# Altium schematic sheet Sensors_Schematic.SchDoc
size A; SheetNumber: 3; SheetTotal: 3
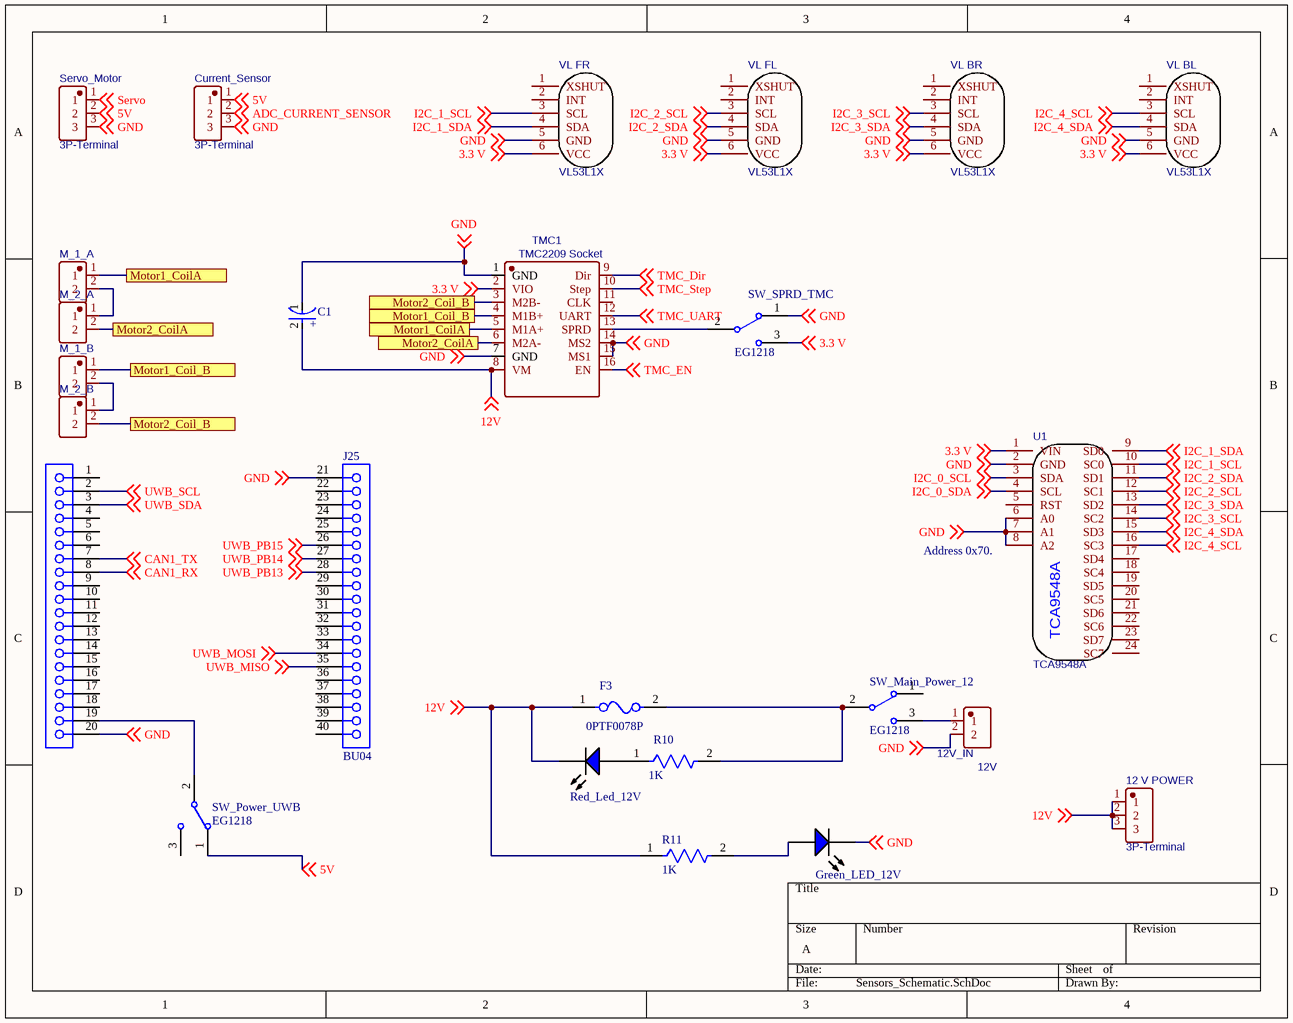
[diagram p0: Sensors_Schematic.SchDoc]

## Parts
12_V_POWER  3P-Terminal  [CONN-TH_3P-P5.00_KF126-5.0-3P]
12V  12V_IN  [CONN-TH_P5.00_KF126-5.0-2P]
C1  EEUFM1E101B  [FP-RAD-TH-D_6_3_0_5-L_11-MFG]  (value not drawn)
Current_Sensor  3P-Terminal  [CONN-TH_3P-P5.00_KF126-5.0-3P]
F3  0PTF0078P  [FP-0PTF0078P-MFG]
Green_LED_12V  WP710A10QBC/D  [KING-WP710A10QBCD_V]  (value not drawn)
J25  BU04  [BU04_KIT_N]
M_1_A  (no value)  [CONN-TH_P5.00_KF126-5.0-2P]
M_1_B  (no value)  [CONN-TH_P5.00_KF126-5.0-2P]
M_2_A  (no value)  [CONN-TH_P5.00_KF126-5.0-2P]
M_2_B  (no value)  [CONN-TH_P5.00_KF126-5.0-2P]
R10  1K  [FP-MFR-12-MFG]
R11  1K  [FP-MFR-12-MFG]
Red_Led_12V  WP710A10QBC/D  [KING-WP710A10QBCD_V]  (value not drawn)
Servo_Motor  3P-Terminal  [CONN-TH_3P-P5.00_KF126-5.0-3P]
SW_Main_Power_12  EG1218  [ESWI-EG1218_V]
SW_Power_UWB  EG1218  [ESWI-EG1218_V]
SW_SPRD_TMC  EG1218  [ESWI-EG1218_V]
TMC1  TMC2209 Socket  [COMM-TH_TMC2209SILENTSTEPSTICK]
U1  TCA9548A  [TCA9548A]
VL_BL  VL53L1X  [VL53L1X_BREAKOUT]
VL_BR  VL53L1X  [VL53L1X_BREAKOUT]
VL_FL  VL53L1X  [VL53L1X_BREAKOUT]
VL_FR  VL53L1X  [VL53L1X_BREAKOUT]

## Ports
Motor1_Coil_B (see Sensors_Schematic[1B]), Motor1_Coil_B (see Sensors_Schematic[2B]), Motor1_CoilA (see Sensors_Schematic[1B]), Motor1_CoilA (see Sensors_Schematic[2B]), Motor2_Coil_B (see Sensors_Schematic[1B]), Motor2_Coil_B (see Sensors_Schematic[2B]), Motor2_CoilA (see Sensors_Schematic[1B]), Motor2_CoilA (see Sensors_Schematic[2B])

## Nets
3.3 V: SW_SPRD_TMC.3 TMC1.2(VIO) U1.1(VIN) VL_BL.6(VCC) VL_BR.6(VCC) VL_FL.6(VCC) VL_FR.6(VCC) ; off-sheet 3.3 V
5V: Current_Sensor.1 Servo_Motor.2 SW_Power_UWB.1 ; off-sheet 5V
12V: 12_V_POWER.1 12_V_POWER.2 12_V_POWER.3 C1.2(A) F3.1 R11.1 Red_Led_12V.2(K) TMC1.8(VM) ; off-sheet 12V
ADC_CURRENT_SENSOR: Current_Sensor.2 ; off-sheet ADC_CURRENT_SENSOR
CAN1_RX: J25.8 ; off-sheet CAN1_RX
CAN1_TX: J25.7 ; off-sheet CAN1_TX
GND: 12V.2 C1.1(C) Current_Sensor.3 Green_LED_12V.2(K) J25.20 J25.21 Servo_Motor.3 SW_SPRD_TMC.1 TMC1.1(GND) TMC1.7(GND) TMC1.14(MS2) TMC1.15(MS1) U1.2(GND) U1.6(A0) U1.7(A1) U1.8(A2) VL_BL.5(GND) VL_BR.5(GND) VL_FL.5(GND) VL_FR.5(GND) ; off-sheet GND
I2C_0_SCL: U1.3(SDA) ; off-sheet I2C_0_SCL
I2C_0_SDA: U1.4(SCL) ; off-sheet I2C_0_SDA
I2C_1_SCL: U1.10(SC0) VL_FR.3(SCL) ; off-sheet I2C_1_SCL
I2C_1_SDA: U1.9(SD0) VL_FR.4(SDA) ; off-sheet I2C_1_SDA
I2C_2_SCL: U1.12(SC1) VL_FL.3(SCL) ; off-sheet I2C_2_SCL
I2C_2_SDA: U1.11(SD1) VL_FL.4(SDA) ; off-sheet I2C_2_SDA
I2C_3_SCL: U1.14(SC2) VL_BR.3(SCL) ; off-sheet I2C_3_SCL
I2C_3_SDA: U1.13(SD2) VL_BR.4(SDA) ; off-sheet I2C_3_SDA
I2C_4_SCL: U1.16(SC3) VL_BL.3(SCL) ; off-sheet I2C_4_SCL
I2C_4_SDA: U1.15(SD3) VL_BL.4(SDA) ; off-sheet I2C_4_SDA
Motor1_Coil_B: M_1_B.1 TMC1.4(M1B+) ; port Motor1_Coil_B
Motor1_CoilA: M_1_A.1 TMC1.5(M1A+) ; port Motor1_CoilA
Motor2_Coil_B: M_2_B.2 TMC1.3(M2B-) ; port Motor2_Coil_B
Motor2_CoilA: M_2_A.2 TMC1.6(M2A-) ; port Motor2_CoilA
Servo: Servo_Motor.1 ; off-sheet Servo
TMC_Dir: TMC1.9(Dir) ; off-sheet TMC_Dir
TMC_EN: TMC1.16(EN) ; off-sheet TMC_EN
TMC_Step: TMC1.10(Step) ; off-sheet TMC_Step
TMC_UART: TMC1.12(UART) ; off-sheet TMC_UART
UWB_MISO: J25.35 ; off-sheet UWB_MISO
UWB_MOSI: J25.34 ; off-sheet UWB_MOSI
UWB_PB13: J25.28 ; off-sheet UWB_PB13
UWB_PB14: J25.27 ; off-sheet UWB_PB14
UWB_PB15: J25.26 ; off-sheet UWB_PB15
UWB_SCL: J25.2 ; off-sheet UWB_SCL
UWB_SDA: J25.3 ; off-sheet UWB_SDA
Net12V_1: 12V.1 SW_Main_Power_12.3
NetF3_2: F3.2 R10.2 SW_Main_Power_12.2(COM)
NetGreen_LED_12V_1: Green_LED_12V.1(A) R11.2
NetJ25_19: J25.19 SW_Power_UWB.2(COM)
NetM_1_A_2: M_1_A.2 M_2_A.1
NetM_1_B_2: M_1_B.2 M_2_B.1
NetR10_1: R10.1 Red_Led_12V.1(A)
NetSW_SPRD_TMC_2: SW_SPRD_TMC.2(COM) TMC1.13(SPRD)

Not connected (* = marked no-connect by the designer): J25 1 4 5 6 9 10 11 12 13 14 15 16 17 18 22 23 24 25 29 30 31 32 33 36 37 38 39 40; SW_Main_Power_12 1; SW_Power_UWB 3; TMC1 11(CLK); U1 5(RST) 17(SD4) 18(SC4) 19(SD5) 20(SC5) 21(SD6) 22(SC6) 23(SD7) 24(SC7); VL_BL 1(XSHUT) 2(INT); VL_BR 1(XSHUT) 2(INT); VL_FL 1(XSHUT) 2(INT); VL_FR 1(XSHUT) 2(INT)

## Notes on the sheet
- (near U1) Address 0x70.
- (in symbol CMP-05427-000856-1) +

## Library data of the parts
12_V_POWER Current_Sensor Servo_Motor = Limit Switch: Manufacturer: Cixi Kefa Elec; Manufacturer Part: KF126-5.0-3P; Contributor: thulasikrishna; Supplier: LCSC; Supplier Part: C474901; JLCPCB Part Class: Extended Part; spicePre: U; spiceSymbolName: KF126-5.0-3P
12V M_1_A M_1_B M_2_A M_2_B = KF126-5.0-2P: Manufacturer: Cixi Kefa Elec; Contributor: LCSC; Supplier: LCSC; Supplier Part: C474900; Manufacturer Part: KF126-5.0-2P; spicePre: P; spiceSymbolName: KF126-5.0-2P
C1 = CMP-05427-000856-1: Aluminum Electrolytic Capacitors (Radial Lead Type) 100uF ±20% 25V; Lead Diameter: 0.5mm; Polarity: Polar; Ripple Current: 455mA; Impedance: 130mR; Life (Hours): 2000Hour; Length: 11mm; Min Operating Temperature: -40°C; Termination: Radial; Diameter: 6mm; Lead Pitch: 5mm; Tolerance: 20%; Capacitance: 100uF; Case/Package: Radial; Voltage Rating (DC): 25V; Height - Seated (Max): 0.5inch; RoHS Compliant: Yes; Series: FM; Package Quantity: 2000; Voltage Rating: 25V; Max Operating Temperature: 105°C; Mount: Through Hole; ESR (Equivalent Series Resistance): 130mR; Packaging: Tape and Reel
F3 = CMP-08604-000023-1: FUSE BLOCK CARTRIDGE PCB; Manufacturer: Littelfuse Inc; Number Of Fuses: 1; Conn Orientation: Vertical; Fuse Current: 6.3A; Voltage Rating Ac: 250V; Package: 0; Ambient Temperature Range Low: -30°C; ComponentLink2URL: https://media.digikey.com/pdf/Data%20Sheets/Littelfuse%20PDFs/PTF075_77_78.pdf; Device Class L3: unset; Lead Free: Yes; Device Class L1: Circuit Protection; RoHS: TRUE; Manufacturer Part Number: 0PTF0078P; Ambient Temperature Range High: +85°C; Category: Fuse; Octopart: https://octopart.com/0ptf0078p-littelfuse-13255855; Digikey Description: FUSE BLOCK CARTRIDGE PCB; Height: 11.5mm; ComponentLink2Description: Datasheet; Device Class L2: Fuse Holders; Mouser Description: Fuse Holder 5X20MM Pitch 22/7 UL94V0 Open; Automotive: No; Voltage Rating Dc: 250V
Green_LED_12V Red_Led_12V = CMP-2000-07416-1: Blue LED, 3.3 V, 20 mA, -40 to 85 degC, 2-Pin THD, RoHS, Bulk; Manufacturer: Kingbright; Forward Current: 20mA; LED Size: T-1; Viewing Angle: 20deg; Lens Color/Style: WaterClear; Wavelength/Color Temperature: 470nm; Forward Voltage: 3.3V; Luminous Intensity: 1600mcd; Lens Shape: Dome; Minimum Operating Temperature: -40C; Package Description: 2-Pin Through Hole Device, Dia 3.2 mm; Packaging: Bulk; Maximum Operating Temperature: +85C; Factory Pack Quantity: 500; Mounting Technology: ThroughHole; Datasheet URL: https://datasheet.ciiva.com/2121/wp710a10qbc-d-2121617.pdf; Datasheet Version: Rev. 5B, 09/2014; Type: SolidStateLEDLamp; Package Reference: WP710A10QBCD; Lens Dimensions: 3mmx4.6mm; Product Category: StandardLEDs-ThroughHole; Manufacturer URL: http://www.kingbright.com/; Mounting Style: ThroughHole; RoHS: Details; Illumination Color: Blue
J25 = BU04: BU04_KIT; Contact Resistance: 20mΩ; Gender: Female; Current Rating: 3A; Operating Supply Voltage: 250V; Lead Pitch: 2.54mm; Number of Pins: 40; Orientation: Vertical
R10 R11 = CMP-03413-000012-1: RES MF 1/6W 1% AXIAL; Power Rating: 160mW; Voltage Rating (DC): 200V; Resistance: 10kR; Min Operating Temperature: -55°C; Max Operating Temperature: 155°C; Voltage Rating: 200V; Termination: Axial; Packaging: Ammo Pack; Tolerance: 1%
SW_Main_Power_12 SW_Power_UWB SW_SPRD_TMC = CMP-1696-00002-1: Slide Switch, 500 V, -20 to 70 degC, 3-Pin THD, RoHS; Case\Package: SOT-23-5; Output Current: 150 mA; Nominal Output Voltage: 3.3 V; Max Power Dissipation: 250 mW; Min Input Voltage: 4.3 V; Outputs: 1; Max Input Voltage: 8 V; Dropout Voltage: 300 mV; PackageDescription: 3-Pin Through Hole Device, Body 11.6 x 4 mm, Pitch 2.5 mm; ComponentLink1URL: http://www.e-switch.ch/en/; RoHSCompliant: true; Length: 3 mm; ComponentLink1Description: Manufacturer URL; Power Rating: 250 mW; Mount: Surface Mount; Max Operating Temperature: 85 degC; REACH SVHC: No SVHC; Radiation Hardening: No; Height: 1.3 mm; Pins: 5; Max Ouput Current: 150 mA; Output Voltage: 3.3 V; Width: 1.8 mm; Package Quantity: 3000; ComponentLink2URL: https://www.e-switch.com/system/asset/product_line/data_sheet/119/EG.pdf; Min Operating Temperature: -40 degC; ComponentLink2Description: Datasheet; DatasheetVersion: Oct-15; PackageReference: EG1218; Packaging: Tape and Reel
TMC1 = TMC2209 Socket: Manufacturer: TRINAMIC; Contributor: plcis; Supplier: LCSC; Supplier Part: C17375345; Manufacturer Part: TMC2209 Socket; JLCPCB Part Class: Extended Part; spicePre: U; spiceSymbolName: TMC2209 Socket
U1 = TCA9548A: Manufacturer: Texas Instruments; Contributor: Dompie; Manufacturer Part: TCA9548A; Supplier: Adafruit; Supplier Part: 2717; link: https://www.adafruit.com/product/2717; spicePre: U; spiceSymbolName: TCA9548A
VL_BL VL_BR VL_FL VL_FR = VL53L1X_BREAKOUT COPY: Manufacturer Part: VL53L0X Time-of-Flight Distance Sensor VL53L0X; Contributor: freddyka; spicePre: U; spiceSymbolName: VL53L1X_BREAKOUT COPY